# Altium schematic sheet Data logger based on stm32.SchDoc: =Data logger
size A3; SheetNumber: 1; SheetTotal: 1
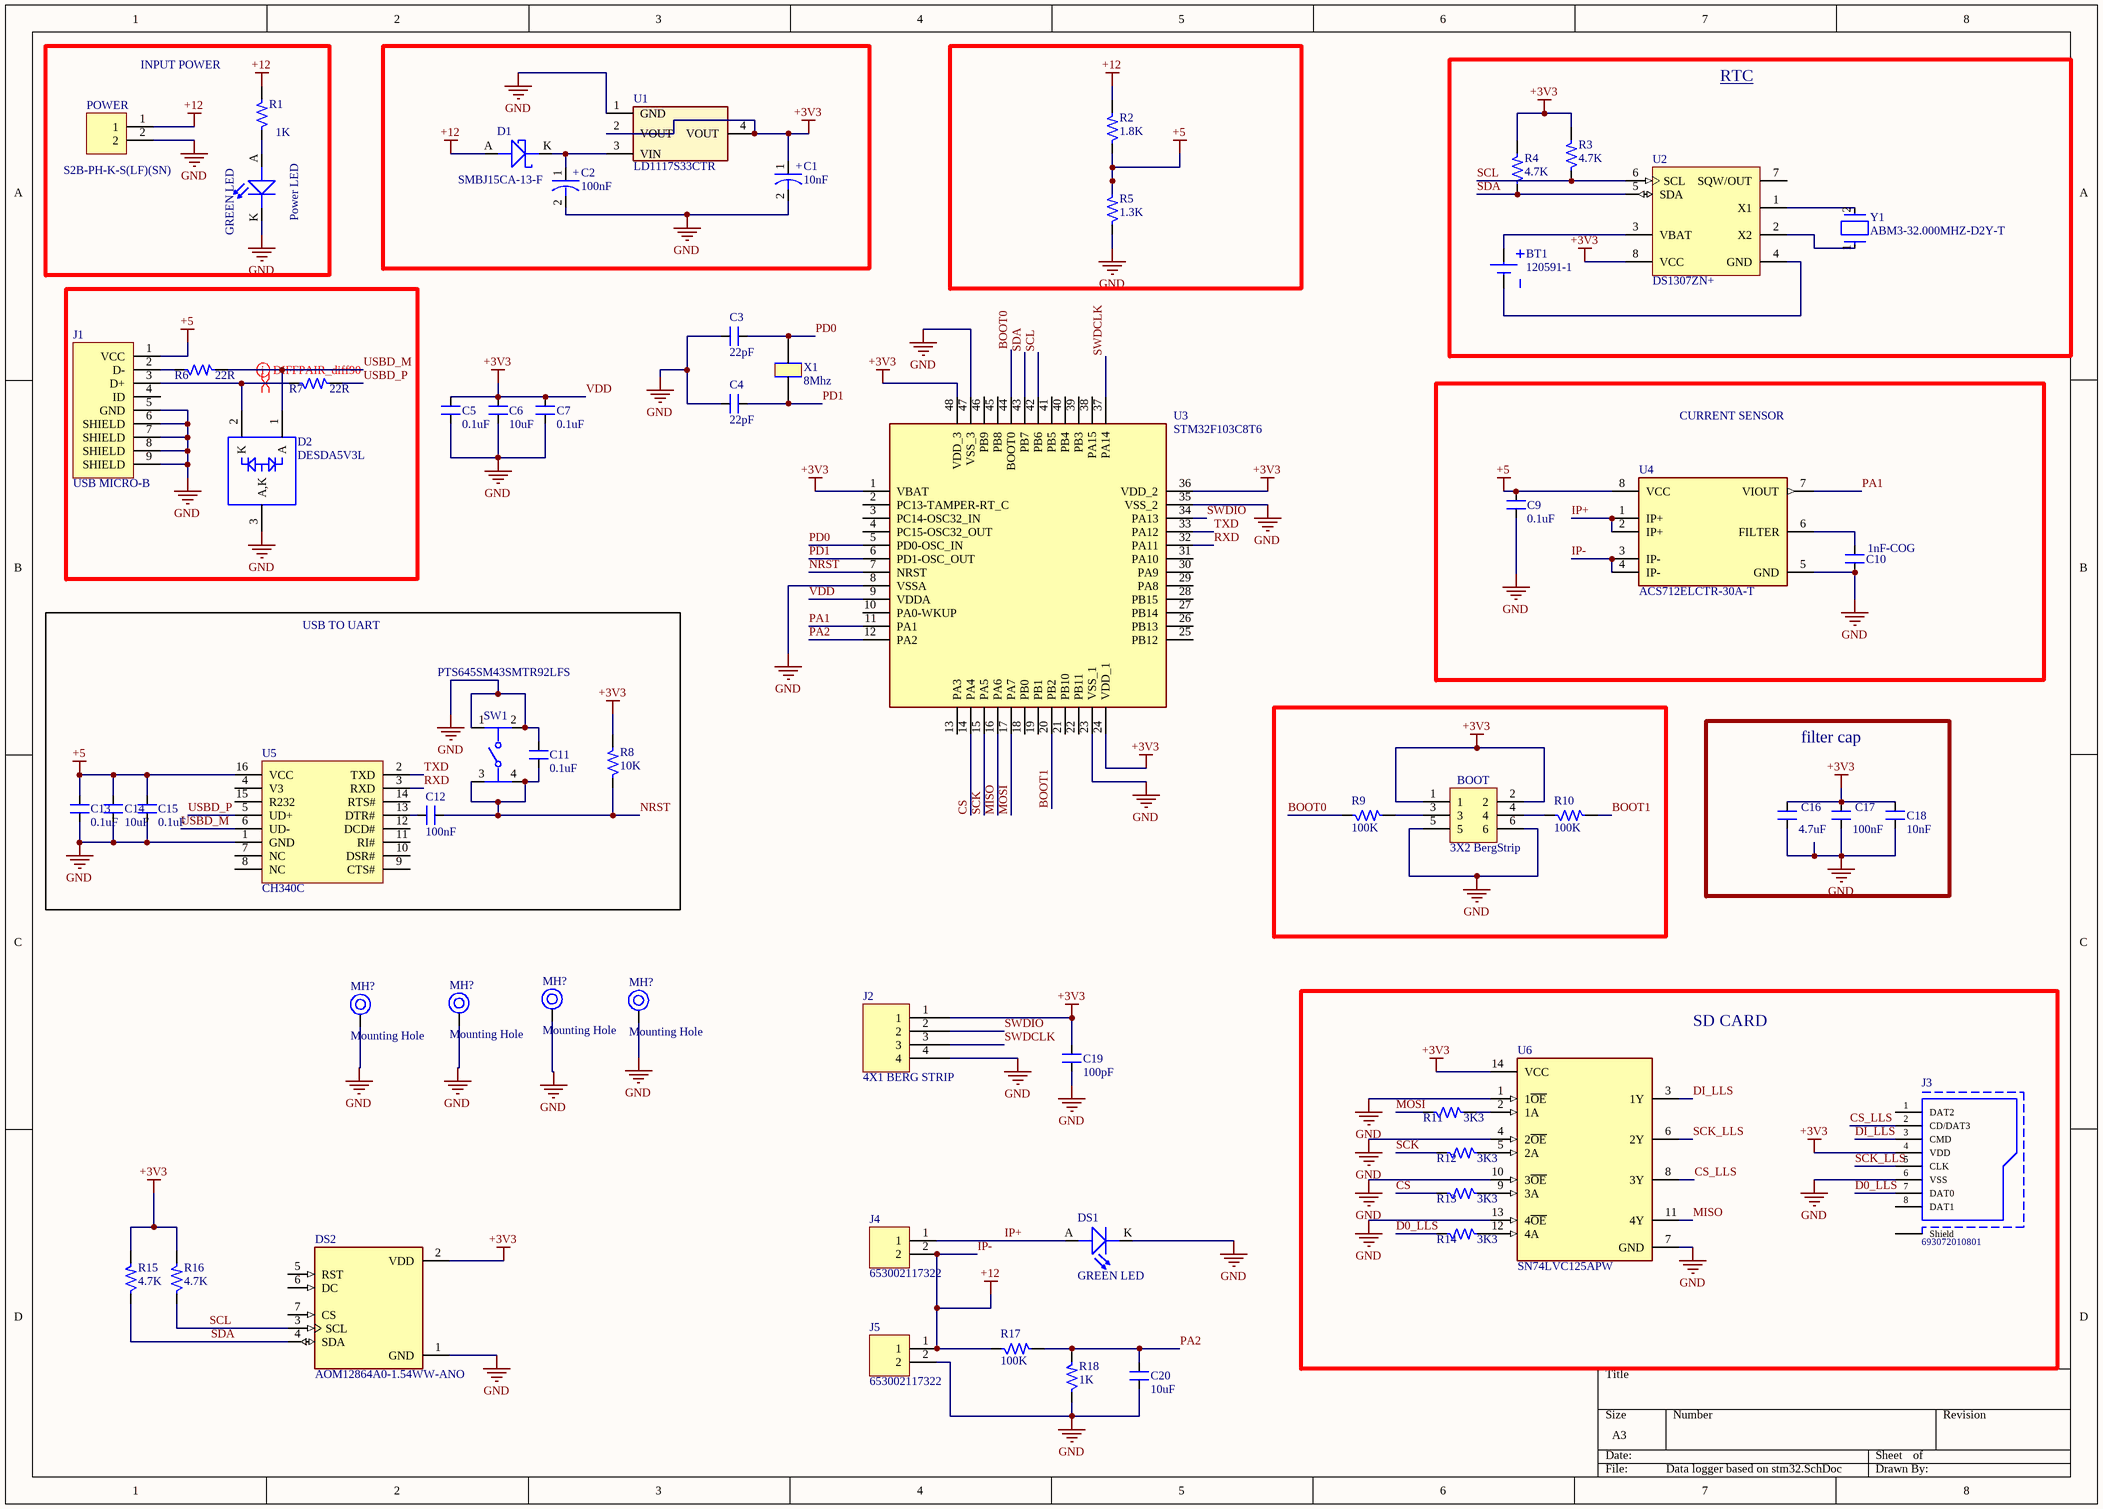
[diagram p0: Data logger based on stm32.SchDoc]

## Parts
(Parts that share a designator on the sheet are numbered #1, #2 ... from top to bottom, then left to right.)
BOOT  3X2 BergStrip  [CON6_100_59D78_TH_ST_Duplicate]
BT1  120591-1  [TECO-120591-1-2_V]
C1  10nF  [ACAP_P236_D305_H303_RAD]
C2  100nF  [ACAP_P236_D305_H303_RAD]
C3  22pF  [CAP_0805]
C4  22pF  [CAP_0805]
C5  0.1uF  [CAP_0805]
C6  10uF  [CAP_1206]
C7  0.1uF  [CAP_0805]
C9  0.1uF  [CAP_0805]
C10  1nF-COG  [CAP_0805]
C11  0.1uF  [CAP_0805]
C12  100nF  [CAP_0805]
C13  0.1uF  [CAP_0805]
C14  10uF  [CAP_1206]
C15  0.1uF  [CAP_0805]
C16  4.7uF  [CAP_0805]
C17  100nF  [CAP_0805]
C18  10nF  [CAP_0805]
C19  100pF  [CAP_0805]
C20  10uF  [CAP_1206]
D1  SMBJ15CA-13-F  [DIO_SMB_DO-214AA]
D2  DESDA5V3L  [SOT 23-3]
DS1  GREEN LED  [LED_0805]
DS2  AOM12864A0-1.54WW-ANO  [LCD_AOM12864A0-1.54WW-ANO]
J1  USB MICRO-B  [CON_10118192-0001LF_SMD]
J2  4X1 BERG STRIP  [CON4_100_40D72_TH_ST_MALE]
J3  693072010801  [693072010801]
J4  653002117322  [CON2_50_653002117322_TH_RA]
J5  653002117322  [CON2_50_653002117322_TH_RA]
MH?#1  Mounting Hole  [MOUNTING]
MH?#2  Mounting Hole  [MOUNTING]
MH?#3  Mounting Hole  [MOUNTING]
MH?#4  Mounting Hole  [MOUNTING]
POWER  S2B-PH-K-S(LF)(SN)  [CON2_78_S2B-PH-K-S_TH_RA]
Power_LED  GREEN LED  [LED_0805]
R1  1K  [RES_0603]
R2  1.8K  [RES_0603]
R3  4.7K  [RES_0603]
R4  4.7K  [RES_0603]
R5  1.3K  [RES_0603]
R6  22R  [RES_0603]
R7  22R  [RES_0603]
R8  10K  [RES_0603]
R9  100K  [RES_0603]
R10  100K  [RES_0603]
R11  3K3  [RES_0603]
R12  3K3  [RES_0603]
R13  3K3  [RES_0603]
R14  3K3  [RES_0603]
R15  4.7K  [RES_0603]
R16  4.7K  [RES_0603]
R17  100K  [RES_0603]
R18  1K  [RES_0603]
SW1  PTS645SM43SMTR92LFS  [FP-PTS645SM43SMTR92LFS-MFG]
U1  LD1117S33CTR  [SOT223_3]
U2  DS1307ZN+  [S8+2_N]
U3  STM32F103C8T6  [LQFP-48_19.6_393_58X11_SMD]
U4  ACS712ELCTR-30A-T  [FP-LC-8-IPC_C]
U5  CH340C  [SOIC16_50_284_25X90_SMT]
U6  SN74LVC125APW  [FP-PW0014A-IPC_C]
X1  8Mhz  [XTAL_314_240X47_SMD]
Y1  ABM3-32.000MHZ-D2Y-T  [FP-ABM3-MFG]

## Blocks framed on the sheet
INPUT POWER: POWER Power_LED R1
RTC: BT1 R3 R4 U2 Y1
CURRENT SENSOR: C9 C10 U4
USB TO UART: C11-C15 R8 SW1 U5
filter cap: C16-C18
SD CARD: J3 R11-R14 U6

## Nets
+5: C9.2 C13.2 C14.2 C15.2 J1.1(VCC) R2.1 R5.2 U4.8(VCC) U5.16(VCC)
GND: BOOT.5 BOOT.6 C1.2 C2.2 C3.1 C4.1 C5.1 C6.1 C7.1 C9.1 C10.1 C11.2 C13.1 C14.1 C15.1 C16.1 C17.1 C18.1 C19.1 C20.1 D2.3(A,K) DS1.K(CATHODE) DS2.1(GND) J1.5(GND) J1.6(SHIELD) J1.7(SHIELD) J1.8(SHIELD) J1.9(SHIELD) J2.4 J3.6(VSS) J5.2 MH?#1.1 MH?#2.1 MH?#3.1 MH?#4.1 POWER.2 Power_LED.K(CATHODE) R5.1 R18.1 SW1.1 SW1.2 U1.1(GND) U3.8(VSSA) U3.23(VSS_1) U3.35(VSS_2) U3.47(VSS_3) U4.5(GND) U5.1(GND) U6.1(1~{OE}) U6.4(2~{OE}) U6.7(GND) U6.10(3~{OE}) U6.13(4~{OE})
IP-: D1.A J4.2 J5.1 POWER.1 R1.2 R2.2 R17.1 U4.3(IP-) U4.4(IP-)  [also labelled +12]
VDD: BOOT.1 BOOT.2 C1.1 C5.2 C6.2 C7.2 C16.2 C17.2 C18.2 C19.2 DS2.2(VDD) J2.1 J3.4(VDD) R3.2 R4.2 R8.2 R15.2 R16.2 U1.2(VOUT) U1.4(VOUT) U2.8(VCC) U3.1(VBAT) U3.9(VDDA) U3.24(VDD_1) U3.36(VDD_2) U3.48(VDD_3) U6.14(VCC)  [also labelled +3V3]
BOOT0: R9.1 U3.44(BOOT0)
BOOT1: R10.2 U3.20(PB2)
CS: R13.1 U3.14(PA4)
CS_LLS: J3.2(CD/DAT3) U6.8(3Y)
D0_LLS: J3.7(DAT0) R14.1
DI_LLS: J3.3(CMD) U6.3(1Y)
IP+: DS1.A(ANODE) J4.1 U4.1(IP+) U4.2(IP+)
MISO: U3.16(PA6) U6.11(4Y)
MOSI: R11.1 U3.17(PA7)
NRST: C11.1 C12.1 R8.1 SW1.3 SW1.4 U3.7(NRST)
PA1: U3.11(PA1) U4.7(VIOUT)
PA2: C20.2 R17.2 R18.2 U3.12(PA2)
PD0: C3.2 U3.5(PD0-OSC_IN) X1.2
PD1: C4.2 U3.6(PD1-OSC_OUT) X1.1
RXD: U3.32(PA11) U5.3(RXD)
SCK: R12.1 U3.15(PA5)
SCK_LLS: J3.5(CLK) U6.6(2Y)
SCL: DS2.3(SCL) R3.1 R16.1 U2.6(SCL) U3.42(PB6)
SDA: DS2.4(SDA) R4.1 R15.1 U2.5(SDA) U3.43(PB7)
SWDCLK: J2.3 U3.37(PA14)
SWDIO: J2.2 U3.34(PA13)
TXD: U3.33(PA12) U5.2(TXD)
USBD_M: D2.1(A) R6.2 U5.6(UD-)
USBD_P: R7.2 U5.5(UD+)
NetBOOT_3: BOOT.3 R9.2
NetBOOT_4: BOOT.4 R10.1
NetBT1_1: BT1.1(+) U2.3(VBAT)
NetBT1_2: BT1.2(-) U2.4(GND)
NetC2_1: C2.1 D1.K U1.3(VIN)
NetC10_2: C10.2 U4.6(FILTER)
NetC12_2: C12.2 U5.13(DTR#)
NetD2_2: D2.2(K) J1.3(D+) R7.1
NetJ1_2: J1.2(D-) R6.1
NetPower_LED_A: Power_LED.A(ANODE) R1.1
NetR11_2: R11.2 U6.2(1A)
NetR12_2: R12.2 U6.5(2A)
NetR13_2: R13.2 U6.9(3A)
NetR14_2: R14.2 U6.12(4A)
NetU2_1: U2.1(X1) Y1.2
NetU2_2: U2.2(X2) Y1.1

Not connected (* = marked no-connect by the designer): DS2 5(RST) 6(DC) 7(CS); J1 4(ID); J3 1(DAT2) 8(DAT1) Shield; U2 7(SQW/OUT); U3 2(PC13-TAMPER-RT_C) 3(PC14-OSC32_IN) 4(PC15-OSC32_OUT) 10(PA0-WKUP) 13(PA3) 18(PB0) 19(PB1) 21(PB10) 22(PB11) 25(PB12) 26(PB13) 27(PB14) 28(PB15) 29(PA8) 30(PA9) 31(PA10) 38(PA15) 39(PB3) 40(PB4) 41(PB5) 45(PB8) 46(PB9); U5 4(V3) 7(NC) 8(NC) 9(CTS#) 10(DSR#) 11(RI#) 12(DCD#) 14(RTS#) 15(R232)

## Layout directives
differential pair; differential pair class diff90; net class diff90: NetD2_2, USBD_M

## Notes on the sheet
- (in symbol CAP-P_100uF-25V-20%-RAD) +

## Library data of the parts
BOOT = CON-BS-PLG_3X2-100-ST-TH: 6 Pins, 2 Row 2.54mm Pitch, Straight bergstrip, Male; Manufacturer: NA; Manufacturer Part Number: NA; Case/Package: TH; Supplier-1: SP ROAD; Supplier Part Number-1: NA; Alternate Part Number-1: NA
BT1 = CMP-0438-00001-2: Lithium Battery Holder for CR2032 3V Cell; Manufacturer: TE Connectivity; Packing Type: Tray; Body Shape: Horizontal Cylindrical; AccessRights: 2147483647; RevisionId: 1; Folder: Unified Components\Components\TE Connectivity\Connectors & Connector Components\Power Products\Battery Interconnection Products\; ContentType: Unified Component; ContentTypeGUID: CB3C11C4-E317-11DF-B822-12313F0024A2; ComponentLink1Description: Manufacturer URL; LifeCycleStateGUID: 61E382EE-6656-4F12-9E24-BE9327104A25; FolderGUID: A6761B51-D489-48A3-9180-F4808F45AB79; PartNumber: 120591-1; LifeCycle: Released; ReleaseDate: 20/08/2013 02:50:22 AM; PackageReference: 120591-1; ComponentLink2URL: http://www.te.com/commerce/DocumentDelivery/DDEController?Action=showdoc&DocId=Customer+Drawing%7F120591%7FH%7Fpdf%7FEnglish%7FENG_CD_120591_H.pdf%7F120591-1; DatasheetVersion: Rev. H, 01/2013; PackageDescription: Lithium Battery Holder; ItemGUID: B2C50140-681E-4F62-8DBB-9728605318CE; ItemHRID: CMP-0438-00001; Mounting Technology: Through Hole; ComponentLink1URL: http://www.te.com/; ComponentLink2Description: Datasheet
C1 C2 = CAP-P_100uF-25V-20%-RAD: 100µF 25V Aluminum Electrolytic Capacitors Radial, Can - SMD 1000 Hrs @ 105°C; Manufacturer: Nichicon; Manufacturer Part Number: UWT1E101MCL1GS; Alternate Part Number-1: NA; Case/Package: Radial-SMD; Supplier-1: SP ROAD; Supplier Part Number-1: UWT1E101MCL1GS
C3 C4 = CAP_22PF-50V-5%-0805: 22pF ±5% 50V Ceramic Capacitor C0G, NP0 0805 (2012 Metric); Manufacturer: Yageo; Manufacturer Part Number: CC0805JRNPO9BN220; Alternate Part Number-1: 0805CG220J500NT; Case/Package: 0805; Supplier-1: SIRICOM; Supplier Part Number-1: 0805N220J500CT
C5 C7 C9 C11 C13 C15 = CAP_0.1uF-50V-5%-0805: 0.1µF ±5% 50V Ceramic Capacitor X7R 0805 (2012 Metric); Manufacturer: AVX Corporation; Manufacturer Part Number: 08055C104JAT4A; Alternate Part Number-1: 0805B104M500; Case/Package: 0805; Supplier-1: SIRICOM; Supplier Part Number-1: 0805B104J500CT
C6 C14 C20 = CAP_10uF-50V-10%-1206: 10µF ±10% 50V Ceramic Capacitor X7R 1206 (3216 Metric); Manufacturer: KEMET; Manufacturer Part Number: CL31B106KBHNNNE; Alternate Part Number-1: GRT31CR61H106ME01L; Case/Package: 1206; Supplier-1: SIRICOM; Supplier Part Number-1: CC1206KKX5R9BB106
C10 = CAP_1nF-50V-10%-0805: 1000pF ±10% 50V Ceramic Capacitor C0G, NP0 0805 (2012 Metric); Manufacturer: Yageo; Manufacturer Part Number: C0805C102K5GEC7210; Alternate Part Number-1: 0805CG102J500NT; Case/Package: 0805; Supplier-1: SIRICOM; Supplier Part Number-1: 0805B102K500CT
C12 C17-C19 = CAP_100pF-50V-5%-0805: 100pF ±5% 50V Ceramic Capacitor C0G, NP0 0805 (2012 Metric); Manufacturer: KEMET; Manufacturer Part Number: CC0805JRNPO9BN101; Alternate Part Number-1: NA; Case/Package: 0805; Supplier-1: SIRICOM; Supplier Part Number-1: 0805N101J500LT
C16 = CAP_4.7uF-50V-10%-0805: 4.7µF ±10% 50V Ceramic Capacitor X5R 0805 (2012 Metric); Manufacturer: Yageo; Manufacturer Part Number: GRM21BR61H475KE51L; Alternate Part Number-1: NA; Case/Package: 0805; Supplier-1: SIRICOM; Supplier Part Number-1: CL21A475KBQNNNE
D1 = DIO-T_15V-24V-24.6A-DO214AA: 24.4V Clamp 24.6A Ipp Tvs Diode Surface Mount DO-214AA (SMBJ); Manufacturer: Nexperia; Alternate Part Number-1: NA; Manufacturer Part Number: SMBJ15CA-13-F; Case/Package: DO214AA; Supplier-1: SIRICOM; Supplier Part Number-1: SMBJ15CA-13-F
D2 = DIO-A_DESDA5V3L-SOT23: 15V Clamp 20A (8/20µs) Ipp Tvs Diode Surface Mount SOT-23; Manufacturer: Diodes; Manufacturer Part Number: DESDA5V3L-7; Alternate Part Number-1: NA; Case/Package: SOT-23; Supplier-1: LCSC; Supplier Part Number-1: C343994
DS1 Power_LED = LED_GREEN-2.2-20mA-0805: Green 569nm LED Indication - Discrete 2.1V 0805 (2012 Metric); Manufacturer: Vishay Lite-On; Manufacturer Part Number: LTST-C171GKT; Alternate Part Number-1: NA; Case/Package: 0805; Supplier-1: SP ROAD; Supplier Part Number-1: LTST-C171GKT
DS2 = AOM12864A0-1.54WW-ANO: Non-Touch Graphic LCD Display Module - White OLED SPI 1.54 (39.12mm) 128 x 64; MF: Orient Display; Price: None; Value: *; Package: None; Check_prices: https://www.snapeda.com/parts/AOM12864A0-1.54WW-ANO/Orient+Display/view-part/?ref=eda; SnapEDA_Link: https://www.snapeda.com/parts/AOM12864A0-1.54WW-ANO/Orient+Display/view-part/?ref=snap; Purchase-URL: https://pricing.snapeda.com/search/part/AOM12864A0-1.54WW-ANO/?ref=eda; Availability: In Stock; MP: AOM12864A0-1.54WW-ANO
J1 = CON_USB2.0_MICROB-SMD: USB - micro B USB 2.0 Receptacle Connector 5 Position Surface Mount, Right Angle; Manufacturer: ICC; Manufacturer Part Number: 10118192-0001LF; Alternate Part Number-1: NA; Case/Package: USB MICRO-B SMD; Supplier-1: SUNROM; Supplier Part Number-1: MICRO USB
J2 = CON-BS-PLG_4X1-100-ST-TH: 4 Pins, 1 Row 2.54mm Pitch, Straight bergstrip, Male; Manufacturer: NA; Manufacturer Part Number: NA; Case/Package: TH-CON; Supplier-1: SP ROAD; Supplier Part Number-1: NA; Alternate Part Number-1: NA
J3 = CMP-1502-00164-1: WR-CRD Micro SD Card Connector, Hinge Type; Manufacturer: Wurth Elektronik; Withstanding Voltage: 500VAC; Rated Current: 0.5A; Working Voltage: 100VAC; Datasheet URL: https://katalog.we-online.de/em/datasheet/693072010801.pdf; Part Number: 693072010801; Publisher: WurthElektronik; Manufacturer URL: http://www.we-online.de; Mounting Technology: SMT; Package Reference: 693072010801; Packaging: TapeandReel; Operating Temperature: -25to85degC
J4 J5 = CON-PLG_2X1-50-RA-TH: 1 Pins, 1 Row 256mil Pitch, Straight, Male; Manufacturer: JST; Mating Part Number: 653002113322; Crimp Part Number: 653153128130; Alternate Part Number-1: NA; Manufacturer Part Number: 653002117322; Case/Package: TH-CON; Supplier-1: WURTH; Supplier Part Number-1: 653002117322
MH?#1-MH?#4 = MH_3.5H_6D: Manufacturer Part Number: NA; Case/Package: TH; Manufacturer: NA; Supplier-1: NA; Supplier Part Number-1: NA; Alternate Part Number-1: NA
POWER = CON-PLG_2X1-78-RA-TH: 2 Pins, 1 Row 2mm Pitch, Right angle Connector, male; Manufacturer: JST; Mating Part Number: PHR-2; Crimp Part Number: ASPHSPH24K51; Alternate Part Number-1: NA; Manufacturer Part Number: S2B-PH-K-S(LF)(SN); Case/Package: TH-CON; Supplier-1: ARROW; Supplier Part Number-1: S2B-PH-K-S(LF)(SN)
R1 R18 = RES_1K-0.1W-1%-0603: 1 kOhms ±1% 0.1W, 1/10W Chip Resistor 0603 (1608 Metric) Automotive AEC-Q200 Thick Film; Manufacturer: Walsin; Manufacturer Part Number: WR06X1001FTL; Alternate Part Number-1: 0603WAF1001T5E; Case/Package: 0603; Supplier-1: SIRICOM; Supplier Part Number-1: WR06X1001FTL
R2 R5-R8 R11-R14 = RES_3.3K-0.1W-1%-0603: 3.3 kOhms ±1% 0.1W, 1/10W Chip Resistor 0603 (1608 Metric) Automotive AEC-Q200 Thick Film; Manufacturer: Wilson; Manufacturer Part Number: WR06X3301FTL; Alternate Part Number-1: 0603WAF3301T5E; Case/Package: 0603; Supplier-1: SIRICOM; Supplier Part Number-1: WR06X3301FTL
R3 R4 R15 R16 = RES_4.7K-0.1W-1%-0603: 4.7 kOhms ±1% 0.1W, 1/10W Chip Resistor 0603 (1608 Metric) Moisture Resistant Thick Film; Manufacturer: Walsin; Manufacturer Part Number: WR06X4701FTL; Alternate Part Number-1: MR06X4701FTL; Case/Package: 0603; Supplier-1: SIRICOM; Supplier Part Number-1: WR06X4701FTL
R9 R10 R17 = RES_100K-0.1W-1%-0603: 100 kOhms ±1% 0.1W, 1/10W Chip Resistor 0603 (1608 Metric) Automotive AEC-Q200 Thick Film; Manufacturer: Stackpole Electronics; Manufacturer Part Number: RMCF0603FT100K; Alternate Part Number-1: NA; Case/Package: 0603; Supplier-1: Arrow; Supplier Part Number-1: RMCF0603FT100K
SW1 = CMP-2000-05160-2: SWITCH TACTILE SPST-NO 0.05A 12V; Contact Resistance: 100mR; Throw Configuration: SPST; Illumination Type: Non-Illuminated; Mechanical Life: 100000Cycles; Current Rating: 50mA; Switch Function: Off-Mom; Actuator Length: 0.85mm; Actuator Material: Nylon; Actuator Type: Standard; Operating Force: 160gf; Min Operating Temperature: -20°C; REACH SVHC: No SVHC; Termination: Gull Wing; Case/Package: SMD/SMT; Packaging: Tape and Reel; Mount: Surface Mount; Voltage Rating (DC): 12V; Orientation: Straight; Lead Free: Lead Free; Contact Material: Silver; Color: Black; Max Current Rating: 50mA; Contact Plating: Silver; Depth: 9mm; Package Quantity: 1; Max Voltage Rating (DC): 12V; Length: 6mm; Max Operating Temperature: 60°C
U1 = REG_15V-3.3V-0.9A-12W-SOT223: Linear Voltage Regulator IC 1 Output 800mA SOT-223; Manufacturer: STMicroelectronics; Alternate Part Number-1: NA; Manufacturer Part Number: LD1117S33CTR; Case/Package: SOT223; Supplier-1: SP ROAD; Supplier Part Number-1: LD1117S33CTR
U2 = CMP-0254-00324-1: 64 x 8, Serial, I2C Real-Time Clock, 5.0V, 8-Pin SO, -40 to 85 degC, Pb-Free; PackageDescription: 8-Pin Small-Outline IC, Narrow (0.15in), 1.27 mm Pitch, SOIC (N), Pb-Free; PackageVersion: revC, 2010; ComponentLink3URL: http://pdfserv.maxim-ic.com/package_dwgs/21-0041.PDF; Code_IPC: SOIC127P600-8; Code_JEDEC: MS-012-AA; ComponentLink2Description: Datasheet; ComponentLink3Description: Package Specification; PackageReference: S8+2; DatasheetVersion: 10-Feb-2008; ComponentLink2URL: http://datasheets.maxim-ic.com/en/ds/DS1307.pdf; ComponentLink1Description: Manufacturer URL; ComponentLink1URL: http://www.maxim-ic.com
U3 = IC_STM32F103C8T6: ARM® Cortex®-M3 STM32F1 Microcontroller IC 32-Bit 72MHz 64KB (64K x 8) FLASH 48-LQFP (7x7); Manufacturer: STMicroelectronics; Alternate Part Number-1: NA; Manufacturer Part Number: STM32F103C8T6; Case/Package: LQFP48; Supplier-1: LCSC; Supplier Part Number-1: STM32F103C8T6
U4 = CMP-2000-04990-2: SENSOR CURRENT HALL 30A AC/DC; Bandwidth: 80kHz; Max Supply Current: 13mA; Linearity: 1.5%; Operating Supply Voltage: 5V; Quiescent Current: 10mA; Number of Channels: 1; Polarity: Bidirectional; Min Supply Voltage: 4.5V; Response Time: 5us; Sensitivity: 66mV/A; Max Supply Voltage: 5.5V; Current Sensing: 30A; REACH SVHC: No SVHC; Mount: Surface Mount; Max Operating Temperature: 85°C; Packaging: Cut Tape; Frequency: 80kHz; Series: -; Termination: SMD/SMT; RoHS Compliant: Yes; Number of Pins: 8; Package Quantity: 1; Accuracy: 1.5%; Lead Free: Lead Free; Case/Package: SOIC; Min Operating Temperature: -40°C; Output Current: 10mA
U5 = IC_CH340C: USB Bridge, USB to UART USB 2.0 UART Interface; Manufacturer: Olimex; Alternate Part Number-1: NA; Manufacturer Part Number: CH340C; Case/Package: SOIC16; Supplier-1: LCSC; Supplier Part Number-1: C84681
U6 = CMP-0440-00180-4: IC BUF NON-INVERT 3.6V 14TSSOP; Polarity: Non-Inverting; Turn-On Delay Time: 15.8ns; Operating Supply Voltage: 1.8V; Number of Inputs: 4; High Level Output Current: -24mA; Max Power Dissipation: 500mW; Output Type: 3-STATE; Propagation Delay: 4.6ns; Number of Bits per Element: 1; Min Supply Voltage: 1.65V; Logic Function: Buffer; Number of Output Lines: 3; Low Level Output Current: 24mA; Quiescent Current: 1uA; Mount: Surface Mount; Number of Elements: 4; Max Operating Temperature: 125°C; Number of Input Lines: 4; Series: 74LVC; Termination: SMD/SMT; Number of Channels: 4; Max Supply Voltage: 3.6V; Number of Bits: 4; REACH SVHC: No SVHC; Length: 5mm; Technology: CMOS; Number of Pins: 14; Lead Free: Lead Free; RoHS Compliant: Yes; Radiation Hardening: No; Packaging: Rail/Tube; Width: 4.4mm; Min Operating Temperature: -40°C; Height: 1.15mm; Number of Outputs: 4; Package Quantity: 90; Case/Package: TSSOP
X1 = XTAL_8MHZ-ECS-80-32-5PX-SMD: 8MHz ±30ppm Crystal 32pF 60 Ohms HC-49/US; Manufacturer: Fox Electronics; Manufacturer Part Number: ECS-80-32-5PX-TR; Alternate Part Number-1: NA; Case/Package: SMD/SMT; Supplier-1: SP ROAD; Supplier Part Number-1: ECS-80-32-5PX-TR
Y1 = CMP-27762-013588-1: Crystal 32MHz ±20ppm 18pF SMD-2 5mm x 3.2mm; Frequency Stability: 30ppm; ESR (Equivalent Series Resistance): 25R; Frequency: 32MHz; Max Operating Temperature: 85°C; Width: 0.126inch; Tolerance: 20ppm; Load Capacitance: 18pF; Resistor Type: Ceramic; Height: 0.051inch; Length: 5mm; Frequency Tolerance: 20ppm; Depth: 3.2mm; Min Operating Temperature: -40°C; Number of Pins: 2; Package Quantity: 1000; Case/Package: CSMD; RoHS Compliant: Yes; REACH SVHC: No SVHC; Packaging: Tape and Reel; Lead Free: Lead Free; Series: ABM3; Mount: Surface Mount; Termination: SMD/SMT